# Altium schematic sheet 多功能数字电表.SchDoc
size 254 x 101 mm
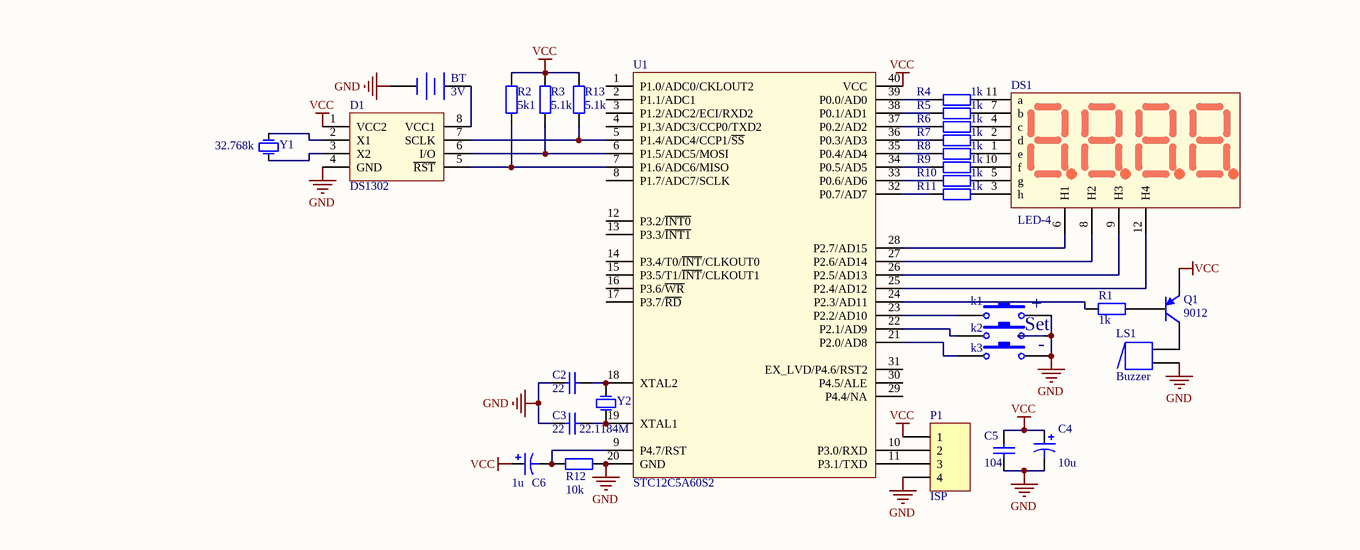
[diagram p0: 多功能数字电表.SchDoc]

## Parts
BT  3V  [rb150]
C2  22  [cap]
C3  22  [cap]
C4  10u  [RB.1/.2]
C5  104  [cap]
C6  1u  [RB.1/.2]
D1  DS1302  [DS1302]
DS1  LED-4  [7SEG_036*4]
k1  +  [SW-4]
k2  Set  [SW-4]
k3  -  [SW-4]
LS1  Buzzer  [BUZZER]
P1  ISP  [sip4]
Q1  9012  [to-92]
R1  1k  [AXIAL-0.3]
R2  5k1  [AXIAL-0.3]
R3  5.1k  [AXIAL-0.3]
R4  1k  [AXIAL-0.3]
R5  1k  [AXIAL-0.3]
R6  1k  [AXIAL-0.3]
R7  1k  [AXIAL-0.3]
R8  1k  [AXIAL-0.3]
R9  1k  [AXIAL-0.3]
R10  1k  [AXIAL-0.3]
R11  1k  [AXIAL-0.3]
R12  10k  [AXIAL-0.3]
R13  5.1k  [AXIAL-0.3]
U1  STC12C5A60S2  [DIP40]
Y1  32.768k  [32768]
Y2  22.1184M  [XTAL]

## Nets
GND: BT.2(-) C2.1 C3.1 C4.2 C5.1 D1.4(GND) k1.2 k2.2 k3.2 LS1.2 P1.4 R12.2 U1.20(GND)
VCC: C4.1 C5.2 C6.1 D1.1(VCC2) P1.1 Q1.1(E) R2.2 R3.2 R13.2 U1.40(VCC)
NetBT_1: BT.1(+) D1.8(VCC1)
NetC2_2: C2.2 U1.18(XTAL2) Y2.2(OSC2)
NetC3_2: C3.2 U1.19(XTAL1) Y2.1(OSC1)
NetC6_2: C6.2 R12.1 U1.9(P4.7/RST)
NetD1_2: D1.2(X1) Y1.2(OSC2)
NetD1_3: D1.3(X2) Y1.1(OSC1)
NetD1_5: D1.5(~{RST}) R2.1 U1.7(P1.6/ADC6/MISO)
NetD1_6: D1.6(I/O) R3.1 U1.6(P1.5/ADC5/MOSI)
NetD1_7: D1.7(SCLK) R13.1 U1.5(P1.4/ADC4/CCP1/~{SS})
NetDS1_1: DS1.1(e) R8.2
NetDS1_2: DS1.2(d) R7.2
NetDS1_3: DS1.3(h) R11.2
NetDS1_4: DS1.4(c) R6.2
NetDS1_5: DS1.5(g) R10.2
NetDS1_6: DS1.6(H1) U1.28(P2.7/AD15)
NetDS1_7: DS1.7(b) R5.2
NetDS1_8: DS1.8(H2) U1.27(P2.6/AD14)
NetDS1_9: DS1.9(H3) U1.26(P2.5/AD13)
NetDS1_10: DS1.10(f) R9.2
NetDS1_11: DS1.11(a) R4.2
NetDS1_12: DS1.12(H4) U1.25(P2.4/AD12)
Netk1_1: k1.1 U1.23(P2.2/AD10)
Netk2_1: k2.1 U1.22(P2.1/AD9)
Netk3_1: k3.1 U1.21(P2.0/AD8)
NetLS1_1: LS1.1 Q1.3(C)
NetP1_2: P1.2 U1.10(P3.0/RXD)
NetP1_3: P1.3 U1.11(P3.1/TXD)
NetQ1_2: Q1.2(B) R1.1
NetR1_2: R1.2 U1.24(P2.3/AD11)
NetR4_1: R4.1 U1.39(P0.0/AD0)
NetR5_1: R5.1 U1.38(P0.1/AD1)
NetR6_1: R6.1 U1.37(P0.2/AD2)
NetR7_1: R7.1 U1.36(P0.3/AD3)
NetR8_1: R8.1 U1.35(P0.4/AD4)
NetR9_1: R9.1 U1.34(P0.5/AD5)
NetR10_1: R10.1 U1.33(P0.6/AD6)
NetR11_1: R11.1 U1.32(P0.7/AD7)

Not connected (* = marked no-connect by the designer): U1 1(P1.0/ADC0/CKLOUT2) 2(P1.1/ADC1) 3(P1.2/ADC2/ECI/RXD2) 4(P1.3/ADC3/CCP0/TXD2) 8(P1.7/ADC7/SCLK) 12(P3.2/~{INT0}) 13(P3.3/~{INT1}) 14(P3.4/T0/~{INT}/CLKOUT0) 15(P3.5/T1/~{INT}/CLKOUT1) 16(P3.6/~{WR}) 17(P3.7/~{RD}) 29(P4.4/NA) 30(P4.5/ALE) 31(EX_LVD/P4.6/RST2)

## Library data of the parts
BT = Battery: Multicell Battery; Published: 24-Mar-1999; LatestRevisionDate: 17-Jul-2002; LatestRevisionNote: Re-released for DXP Platform.; PackageReference: BAT-2; Publisher: Altium Limited; PackageDescription: Battery; 2 Leads
C2 C3 C5 = Cap: Capacitor; Value: 100pF; Published: 8-Jun-2000; LatestRevisionDate: 17-Jul-2002; LatestRevisionNote: Re-released for DXP Platform.; PackageReference: RAD-0.3; Publisher: Altium Limited; PackageDescription: Radial Cap, Thru-Hole; 2 Leads; 0.3 in Pin Spacing
C4 C6 = Cap Pol1: Polarized Capacitor (Radial); Value: 100pF; Published: 8-Jun-2000; LatestRevisionDate: 17-Jul-2002; LatestRevisionNote: Re-released for DXP Platform.; PackageReference: RB7.6-15; Publisher: Altium Limited; PackageDescription: Polarized Capacitor (Radial); 2 Leads
k1-k3 = SW-PB: Switch; Published: 24-Mar-1999; LatestRevisionDate: 17-Jul-2002; LatestRevisionNote: Re-released for DXP Platform.; PackageReference: SPST-2; Publisher: Altium Limited; PackageDescription: Switch; 2 Leads
LS1 = Buzzer: Magnetic Transducer Buzzer; Published: 24-Mar-1999; LatestRevisionDate: 17-Dec-2003; LatestRevisionNote: Schematic revised, PCB Footprint replaced.; DatasheetVersion: 17-Dec-2003; PackageReference: ABSM-1574; Publisher: Altium Limited; PackageDescription: Magnetic Transducer Buzzer; ComponentLink1Description: Manufacturer Link; ComponentLink1URL: http://www.megastar.com/linecard/buzzmode/index.php
P1 = Header 4: Header, 4-Pin; LatestRevisionDate: 17-Jul-2002; LatestRevisionNote: Re-released for DXP Platform.; Publisher: Altium Limited
Q1 = 2N3906: PNP General Purpose Amplifier; Published: 8-Jun-2000; LatestRevisionDate: 15-Jan-2003; LatestRevisionNote: PCB Footprint 'BCY-W3/D4.7' replaced; DatasheetVersion: 1997; PackageVersion: Sep-1998; PackageReference: TO-92A; Publisher: Altium Limited; PackageDescription: TO, Flat Index; 3 In-Line, Axial Leads; Body Dia. 4.5mm; Leads 0.51 x 0.48 mm (max); ComponentLink1Description: Manufacturer Link; ComponentLink1URL: http://www.fairchildsemi.com/; ComponentLink2Description: Datasheet; ComponentLink2URL: http://www.fairchildsemi.com/ds/2N%2F2N3906.pdf
R1 R4-R11 = Res2: Resistor; Published: 8-Jun-2000; LatestRevisionDate: 17-Jul-2002; LatestRevisionNote: Re-released for DXP Platform.; PackageReference: AXIAL-0.4; Publisher: Altium Limited; PackageDescription: Axial Device, Thru-Hole; 2 Leads; 0.4 in Pin Spacing; Value: 1K
R2 R3 R12 R13 = Res2: Resistor; Value: 1K; Published: 8-Jun-2000; LatestRevisionDate: 17-Jul-2002; LatestRevisionNote: Re-released for DXP Platform.; PackageReference: AXIAL-0.4; Publisher: Altium Limited; PackageDescription: Axial Device, Thru-Hole; 2 Leads; 0.4 in Pin Spacing
Y1 Y2 = XTAL: Crystal Oscillator; Published: 8-Jun-2000; LatestRevisionDate: 17-Jul-2002; LatestRevisionNote: Re-released for DXP Platform.; PackageReference: R38; Publisher: Altium Limited; PackageDescription: Crystal, Thru-Hole; 2 Leads; Body 3.1 x 8.2 mm (Dia.xH)